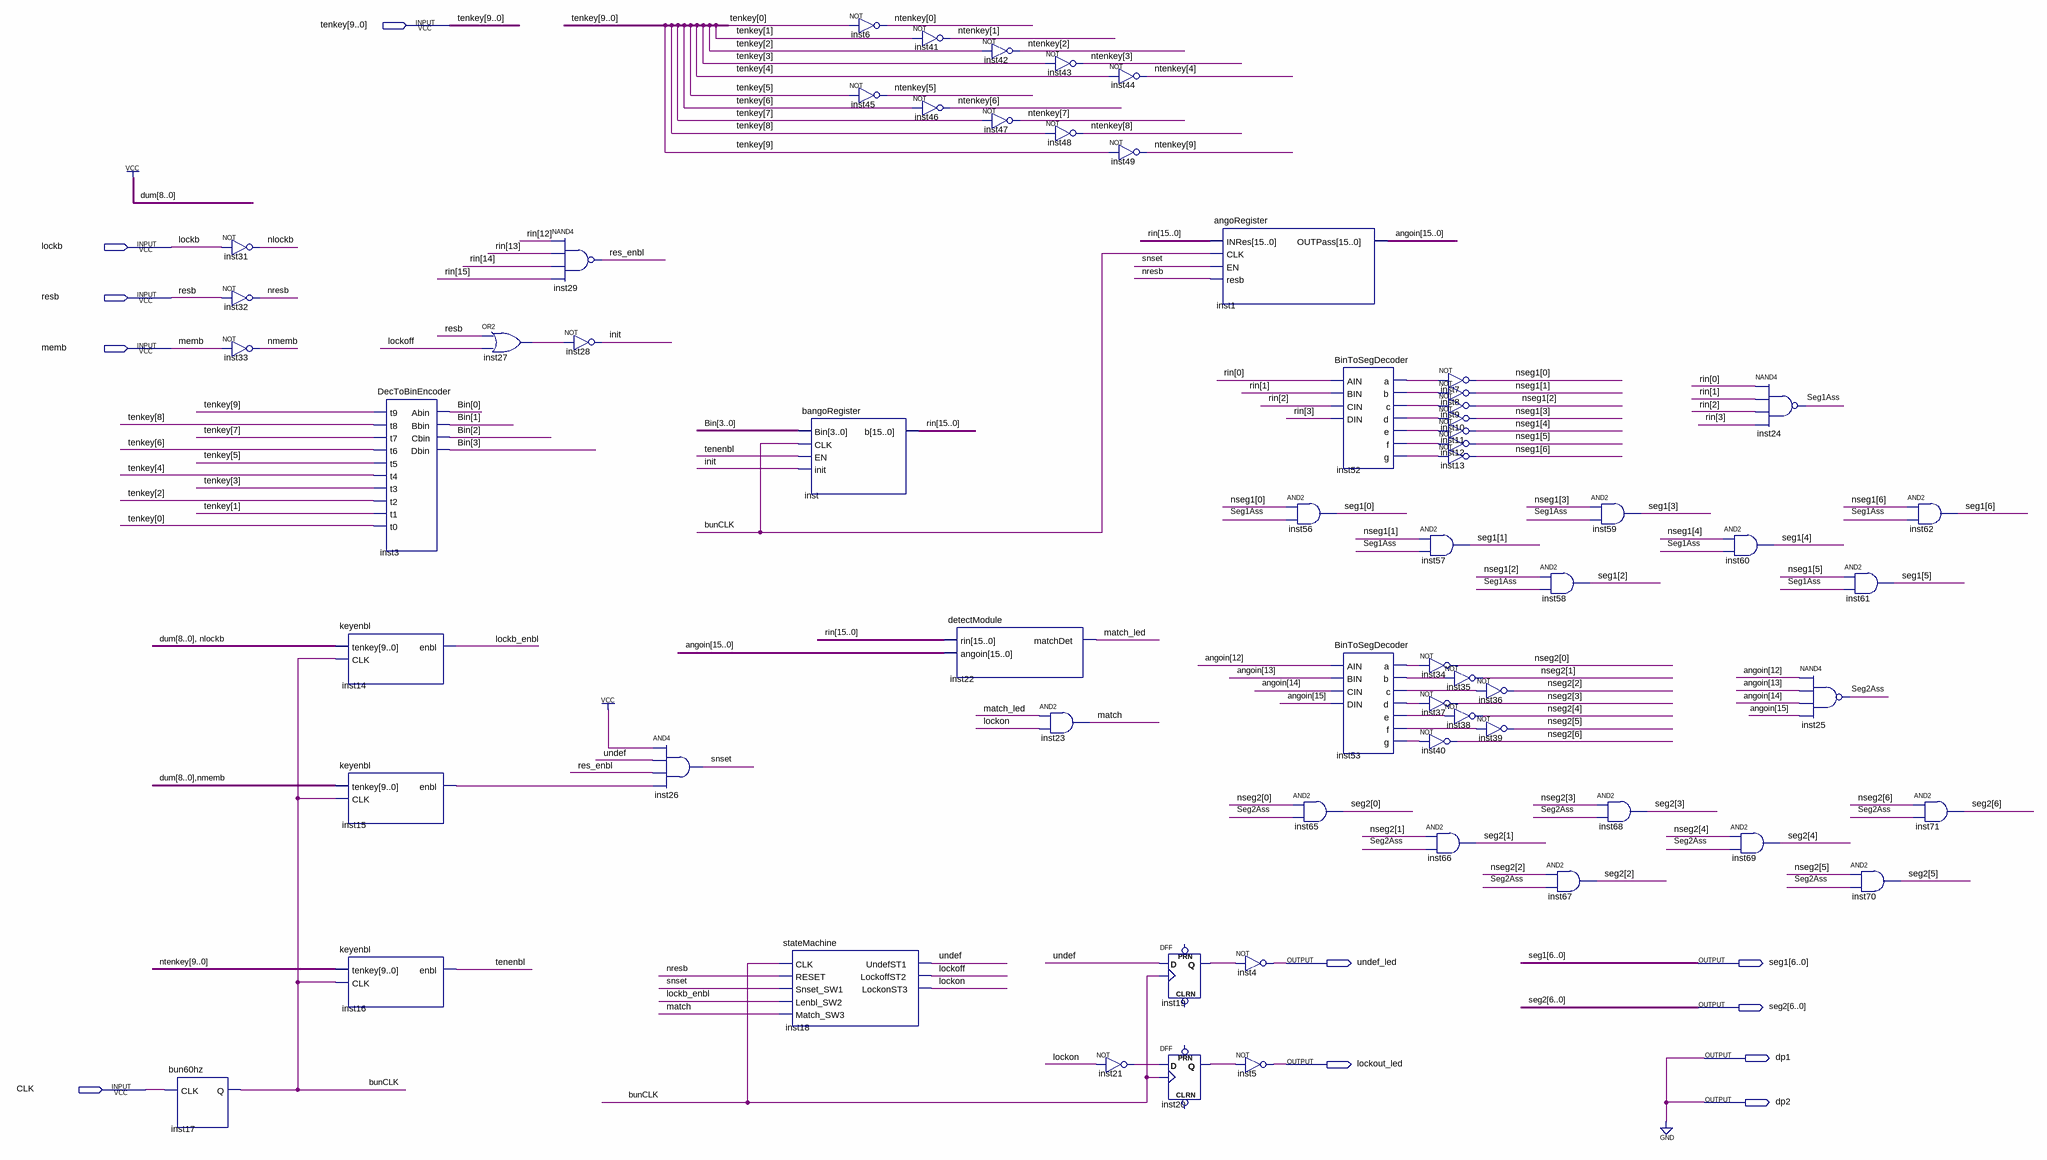
[diagram p0: schematic sheet]
// Quartus schematic denshilock.bdf as structural Verilog: 64 symbols, 11 pins
module denshilock (
  input  [9:0] tenkey,
  input  lockb,
  input  resb,
  input  memb,
  input  CLK,
  output undef_led,
  output [6:0] seg1,
  output [6:0] seg2,
  output dp1,
  output lockout_led,
  output dp2
);

  wire bunCLK, init, inst15_enbl, inst19_q, inst20_q, inst21_out, inst27_out, inst52_a, inst52_b, inst52_c,
       inst52_d, inst52_e, inst52_f, inst52_g, inst53_a, inst53_b, inst53_c, inst53_d, inst53_e, inst53_f,
       inst53_g, lockb_enbl, lockoff, lockon, match, match_led, nlockb, nmemb, nresb, res_enbl, Seg1Ass,
       Seg2Ass, snset, tenenbl, undef;
  wire [3:0] Bin;
  wire [6:0] nseg1, nseg2;
  wire [9:0] ntenkey;
  wire [15:0] angoin, rin;

  bun60hz inst17 (.CLK(CLK), .Q(bunCLK));
  not inst31 (nlockb, lockb);
  not inst32 (nresb, resb);
  not inst33 (nmemb, memb);
  DecToBinEncoder inst3 (
    .t9(tenkey[9]), .t8(tenkey[8]), .t7(tenkey[7]), .t6(tenkey[6]), .t5(tenkey[5]), .t4(tenkey[4]),
    .t3(tenkey[3]), .t2(tenkey[2]), .t1(tenkey[1]), .t0(tenkey[0]), .Abin(Bin[0]), .Bbin(Bin[1]),
    .Cbin(Bin[2]), .Dbin(Bin[3]));
  keyenbl inst14 (.tenkey({{9{1'b1}}, nlockb}), .CLK(bunCLK), .enbl(lockb_enbl));
  keyenbl inst15 (.tenkey({{9{1'b1}}, nmemb}), .CLK(bunCLK), .enbl(inst15_enbl));
  keyenbl inst16 (.tenkey(ntenkey), .CLK(bunCLK), .enbl(tenenbl));
  or inst27 (inst27_out, resb, lockoff);
  nand inst29 (res_enbl, rin[12], rin[13], rin[14], rin[15]);
  not inst28 (init, inst27_out);
  and inst26 (snset, 1'b1, undef, res_enbl, inst15_enbl);
  stateMachine inst18 (
    .CLK(bunCLK), .RESET(nresb), .Snset_SW1(snset), .Lenbl_SW2(lockb_enbl), .Match_SW3(match),
    .UndefST1(undef), .LockoffST2(lockoff), .LockonST3(lockon));
  bangoRegister inst (.Bin(Bin), .CLK(bunCLK), .EN(tenenbl), .init(init), .b(rin));
  not inst6 (ntenkey[0], tenkey[0]);
  not inst45 (ntenkey[5], tenkey[5]);
  not inst41 (ntenkey[1], tenkey[1]);
  not inst46 (ntenkey[6], tenkey[6]);
  not inst42 (ntenkey[2], tenkey[2]);
  not inst47 (ntenkey[7], tenkey[7]);
  detectModule inst22 (.rin(rin), .angoin(angoin), .matchDet(match_led));
  and inst23 (match, match_led, lockon);
  not inst43 (ntenkey[3], tenkey[3]);
  not inst48 (ntenkey[8], tenkey[8]);
  not inst44 (ntenkey[4], tenkey[4]);
  not inst49 (ntenkey[9], tenkey[9]);
  not inst21 (inst21_out, lockon);
  DFF inst19 (.CLK(bunCLK), .D(undef), .Q(inst19_q));  // open: CLRN, PRN
  DFF inst20 (.CLK(bunCLK), .D(inst21_out), .Q(inst20_q));  // open: CLRN, PRN
  angoRegister inst1 (.INRes(rin), .CLK(bunCLK), .EN(snset), .resb(nresb), .OUTPass(angoin));
  not inst4 (undef_led, inst19_q);
  not inst5 (lockout_led, inst20_q);
  and inst56 (seg1[0], nseg1[0], Seg1Ass);
  and inst65 (seg2[0], nseg2[0], Seg2Ass);
  BinToSegDecoder inst52 (
    .AIN(rin[0]), .BIN(rin[1]), .CIN(rin[2]), .DIN(rin[3]), .a(inst52_a), .b(inst52_b), .c(inst52_c),
    .d(inst52_d), .e(inst52_e), .f(inst52_f), .g(inst52_g));
  BinToSegDecoder inst53 (
    .AIN(angoin[12]), .BIN(angoin[13]), .CIN(angoin[14]), .DIN(angoin[15]), .a(inst53_a), .b(inst53_b),
    .c(inst53_c), .d(inst53_d), .e(inst53_e), .f(inst53_f), .g(inst53_g));
  not inst7 (nseg1[0], inst52_a);
  not inst8 (nseg1[1], inst52_b);
  not inst9 (nseg1[2], inst52_c);
  not inst10 (nseg1[3], inst52_d);
  not inst11 (nseg1[4], inst52_e);
  not inst12 (nseg1[5], inst52_f);
  not inst13 (nseg1[6], inst52_g);
  and inst57 (seg1[1], nseg1[1], Seg1Ass);
  not inst34 (nseg2[0], inst53_a);
  not inst35 (nseg2[1], inst53_b);
  not inst37 (nseg2[3], inst53_d);
  not inst38 (nseg2[4], inst53_e);
  not inst40 (nseg2[6], inst53_g);
  and inst66 (seg2[1], nseg2[1], Seg2Ass);
  not inst36 (nseg2[2], inst53_c);
  not inst39 (nseg2[5], inst53_f);
  and inst58 (seg1[2], nseg1[2], Seg1Ass);
  and inst67 (seg2[2], nseg2[2], Seg2Ass);
  and inst59 (seg1[3], nseg1[3], Seg1Ass);
  and inst68 (seg2[3], nseg2[3], Seg2Ass);
  and inst60 (seg1[4], nseg1[4], Seg1Ass);
  and inst69 (seg2[4], nseg2[4], Seg2Ass);
  nand inst24 (Seg1Ass, rin[0], rin[1], rin[2], rin[3]);
  nand inst25 (Seg2Ass, angoin[12], angoin[13], angoin[14], angoin[15]);
  and inst61 (seg1[5], nseg1[5], Seg1Ass);
  and inst70 (seg2[5], nseg2[5], Seg2Ass);
  and inst62 (seg1[6], nseg1[6], Seg1Ass);
  and inst71 (seg2[6], nseg2[6], Seg2Ass);

  assign dp1 = 1'b0;
  assign dp2 = 1'b0;
endmodule
